# Altium schematic sheet AWG_USB_Serial_Quad.SchDoc: RFSOC SAWG
size 420 x 297 mm; Author: Paweł Kulik; DrawnBy: G.Kasprowicz; Address1: Warsaw Univeristy of Technology; Address2: Nowowiejska 15/19; DocumentNumber: 9; Revision: 1; SheetNumber: 9; SheetTotal: 20; EDA_Number: ARTIQ; Projet: ARTIQ/SINARA; ModifiedBy: -; CheckedDate: -; Title2: USB Serial Quad; DivGrp: ISE; Designer: G.Kasprowicz; ProjectName: ARTIQ/SINARA
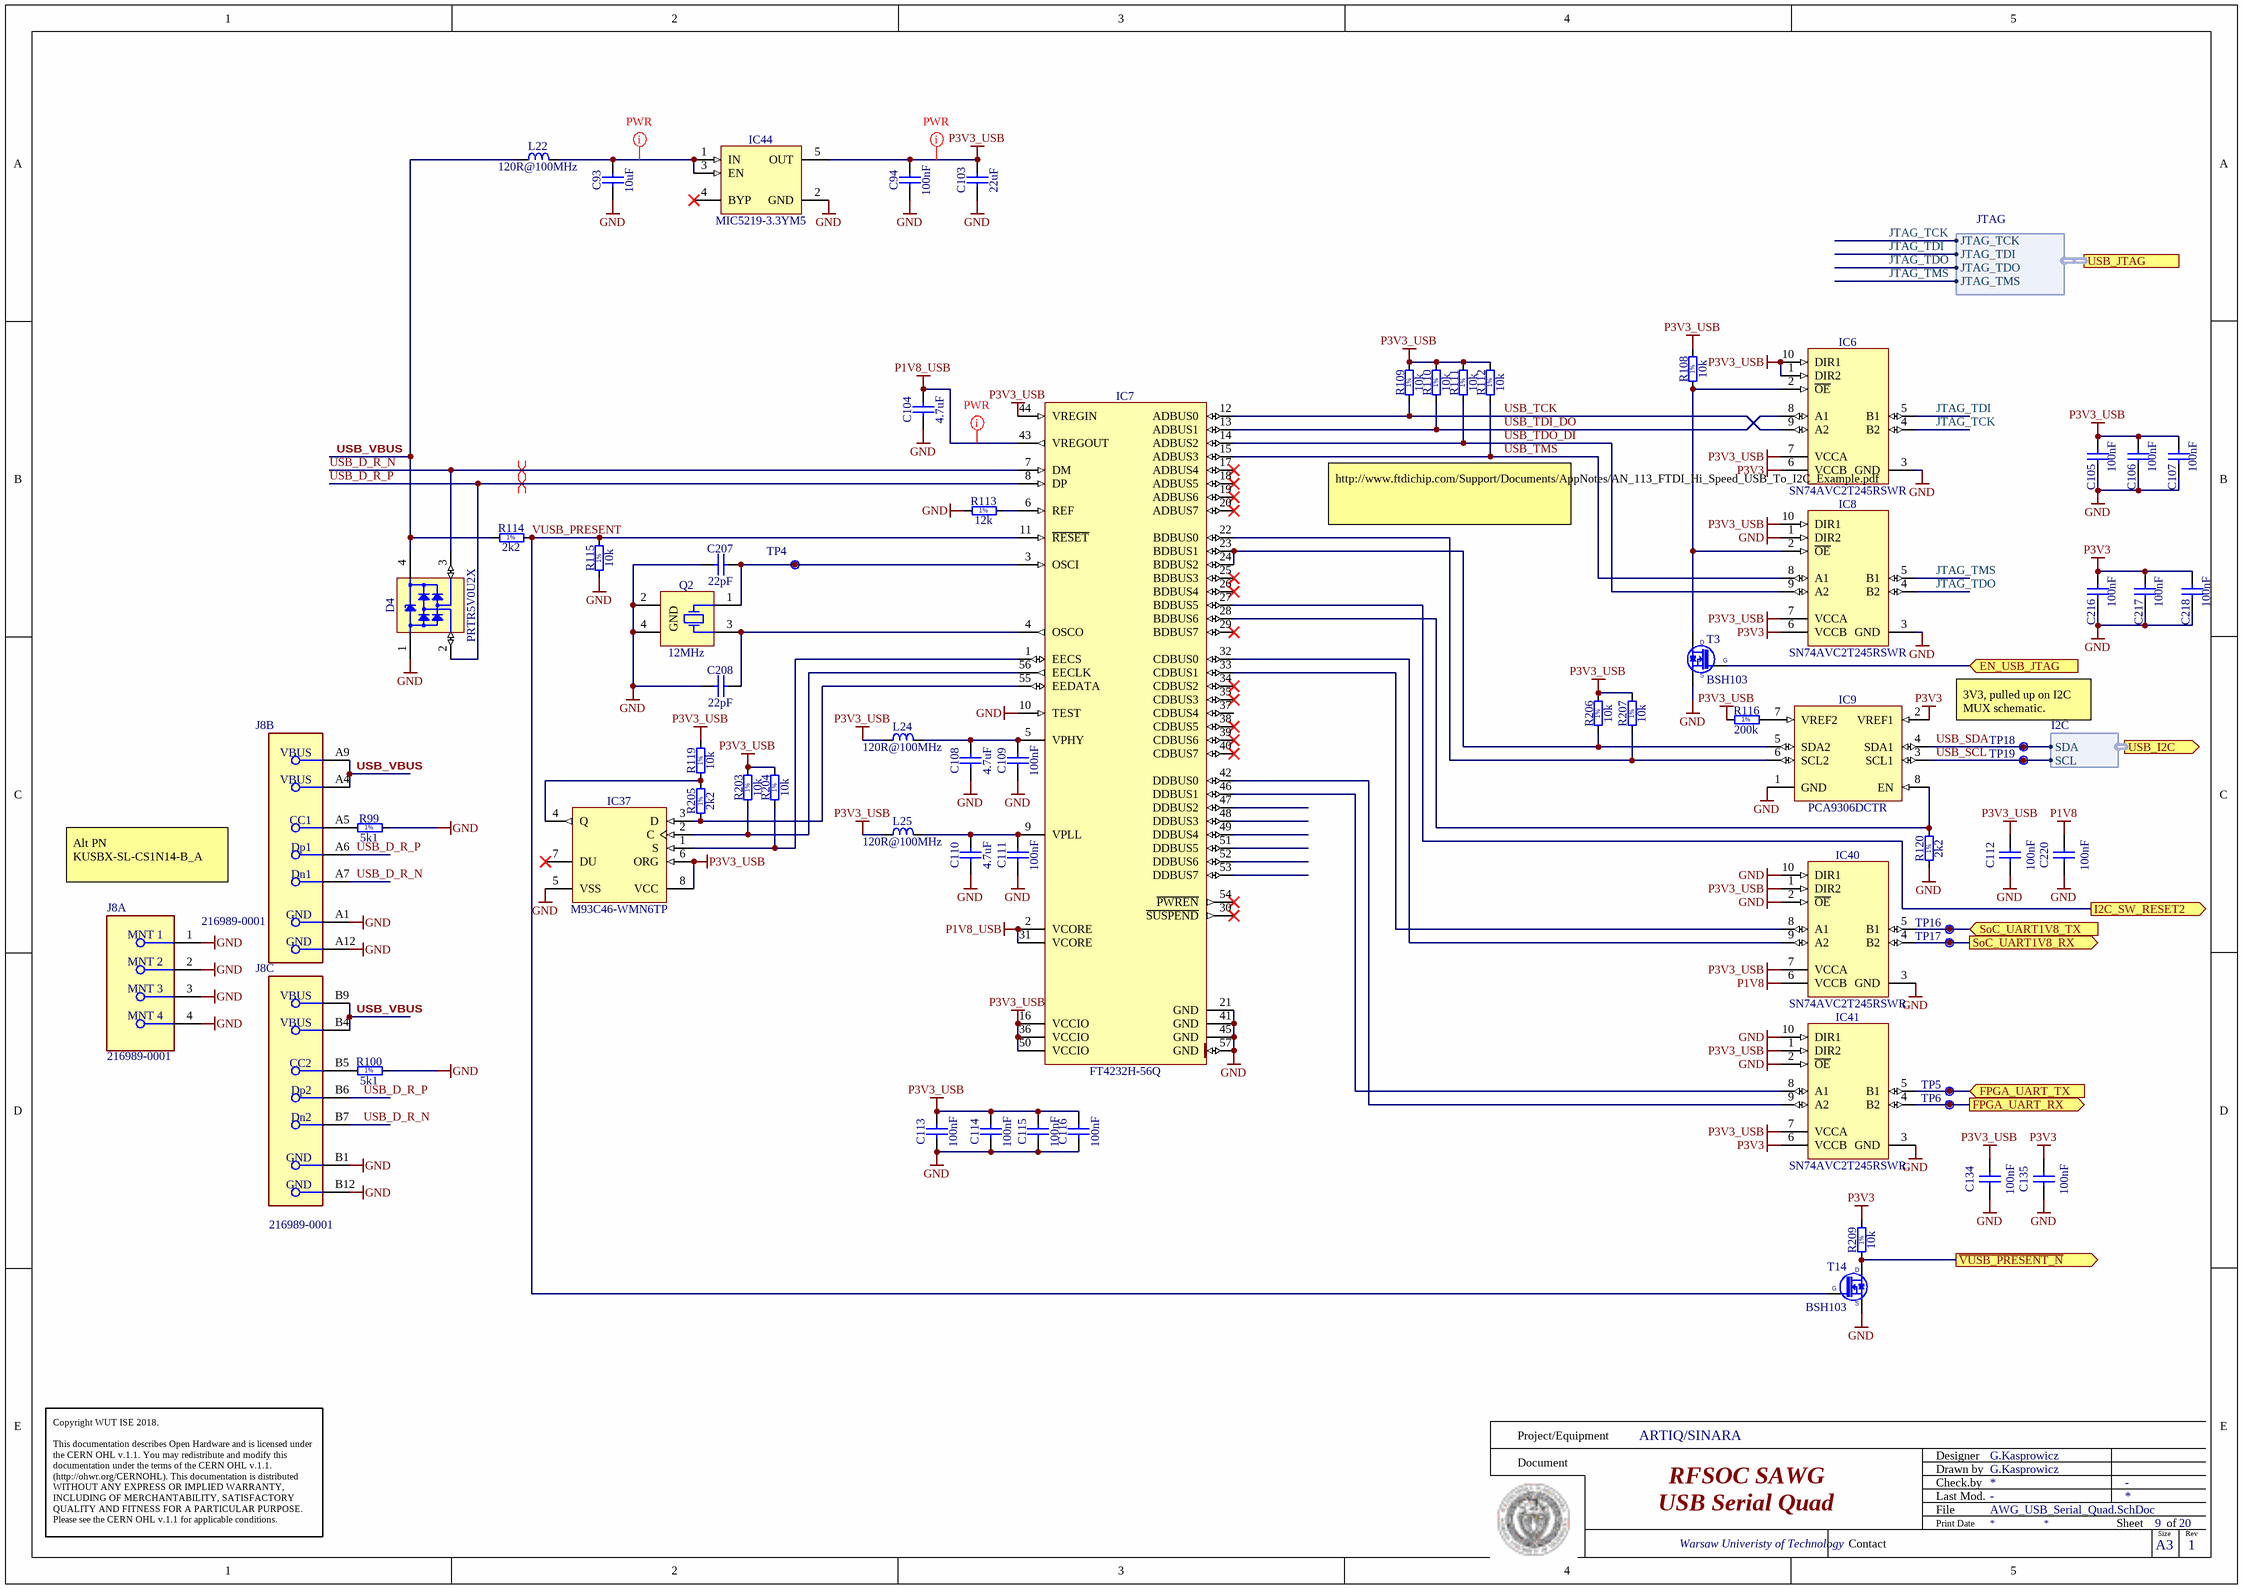
[diagram p0: AWG_USB_Serial_Quad.SchDoc]

## Parts
C93  10uF  [CAPC1608X87N]
C94  100nF  [CAPC1005X55N]
C103  22uF  [CAPC1608X90N]
C104  4.7uF  [CAPC2012X135N]
C105  100nF  [CAPC0603X33N]
C106  100nF  [CAPC0603X33N]
C107  100nF  [CAPC0603X33N]
C108  4.7uF  [CAPC2012X135N]
C109  100nF  [CAPC1005X55N]
C110  4.7uF  [CAPC2012X135N]
C111  100nF  [CAPC1005X55N]
C112  100nF  [CAPC0603X33N]
C113  100nF  [CAPC1005X55N]
C114  100nF  [CAPC1005X55N]
C115  100nF  [CAPC1005X55N]
C116  100nF  [CAPC1005X55N]
C134  100nF  [CAPC0603X33N]
C135  100nF  [CAPC0603X33N]
C207  22pF  [CAPC1005X55N]
C208  22pF  [CAPC1005X55N]
C216  100nF  [CAPC0603X33N]
C217  100nF  [CAPC0603X33N]
C218  100nF  [CAPC0603X33N]
C220  100nF  [CAPC0603X33N]
D4  PRTR5V0U2X  [SOT190P230X110-4N]
IC6  SN74AVC2T245RSWR  [QFN40P140X180X55-10N]
IC7  FT4232H-56Q  [QFN50P800X800X100-57N-S620]
IC8  SN74AVC2T245RSWR  [QFN40P140X180X55-10N]
IC9  PCA9306DCTR  [SOP65P400X130-8N]
IC37  M93C46-WMN6TP  [SOIC127P600X175-8N]
IC40  SN74AVC2T245RSWR  [QFN40P140X180X55-10N]
IC41  SN74AVC2T245RSWR  [QFN40P140X180X55-10N]
IC44  MIC5219-3.3YM5  [SOT95P280X145-5N]
J8  216989-0001  [FP-216989-0001-MFG]  (parts A,B,C of 3)
L22  120R@100MHz  [INDC1608X65N]
L24  120R@100MHz  [INDC1608X65N]
L25  120R@100MHz  [INDC1608X65N]
Q2  12MHz  [XTAL_TXC_7M]
R99  5k1  [RESC1005X40N]
R100  5k1  [RESC1005X40N]
R108  10k  [RESC1005X40N]
R109  10k  [RESC1005X40N]
R110  10k  [RESC1005X40N]
R111  10k  [RESC1005X40N]
R112  10k  [RESC1005X40N]
R113  12k  [RESC1005X40N]
R114  2k2  [RESC1005X40N]
R115  10k  [RESC1005X40N]
R116  200k  [RESC1005X40N]
R119  10k  [RESC1005X40N]
R120  2k2  [RESC1005X40N]
R203  10k  [RESC1005X40N]
R204  10k  [RESC1005X40N]
R205  2k2  [RESC1005X40N]
R206  10k  [RESC1005X40N]
R207  10k  [RESC1005X40N]
R209  10k  [RESC1005X40N]
T3  BSH103  [SOT95P230X110-3N]
T14  BSH103  [SOT95P230X110-3N]
TP4  Test Point  [TPS127]  (value not drawn)  (no BOM)
TP5  Test Point  [TPS127]  (value not drawn)  (no BOM)
TP6  Test Point  [TPS127]  (value not drawn)  (no BOM)
TP16  Test Point  [TPS127]  (value not drawn)  (no BOM)
TP17  Test Point  [TPS127]  (value not drawn)  (no BOM)
TP18  Test Point  [TPS127]  (value not drawn)  (no BOM)
TP19  Test Point  [TPS127]  (value not drawn)  (no BOM)

## Ports
EN_USB_JTAG (in), FPGA_UART_RX (out), FPGA_UART_TX (in), I2C_SW_RESET2 (out), SoC_UART1V8_RX (out), SoC_UART1V8_TX (in), USB_I2C (out, harness I2C), USB_JTAG (harness JTAG), ~{VUSB_PRESENT_N} (out)

## Harnesses
JTAG: JTAG_TCK, JTAG_TDI, JTAG_TDO, JTAG_TMS
I2C: SDA, SCL

## Nets
GND: C93.1 C94.1 C103.1 C104.1 C105.1 C106.1 C107.1 C108.1 C109.1 C110.1 C111.1 C112.1 C113.1 C114.1 C115.1 C116.1 C134.1 C135.1 C207.1 C208.1 C216.1 C217.1 C218.1 C220.1 D4.1(GND) IC6.3(GND) IC7.10(TEST) IC7.21(GND) IC7.41(GND) IC7.45(GND) IC7.57(GND) IC8.1(DIR2) IC8.3(GND) IC9.1(GND) IC37.5(VSS) IC40.2(~{OE}) IC40.3(GND) IC40.10(DIR1) IC41.2(~{OE}) IC41.3(GND) IC41.10(DIR1) IC44.2(GND) J8.1(MNT_1) J8.2(MNT_2) J8.3(MNT_3) J8.4(MNT_4) J8.A1(GND) J8.A12(GND) J8.B1(GND) J8.B12(GND) Q2.2(GND) Q2.4(GND) R99.2 R100.2 R113.1 R115.1 R120.1 T3.2(S) T14.2(S)
P1V8: C220.2 IC40.6(VCCB)
P1V8_USB: C104.2 IC7.2(VCORE) IC7.31(VCORE) IC7.43(VREGOUT)
P3V3: C135.2 C216.2 C217.2 C218.2 IC6.6(VCCB) IC8.6(VCCB) IC9.2(VREF1) IC41.6(VCCB) R209.2
P3V3_USB: C94.2 C103.2 C105.2 C106.2 C107.2 C112.2 C113.2 C114.2 C115.2 C116.2 C134.2 IC6.1(DIR2) IC6.7(VCCA) IC6.10(DIR1) IC7.16(VCCIO) IC7.36(VCCIO) IC7.44(VREGIN) IC7.50(VCCIO) IC8.7(VCCA) IC8.10(DIR1) IC37.6(ORG) IC37.8(VCC) IC40.1(DIR2) IC40.7(VCCA) IC41.1(DIR2) IC41.7(VCCA) IC44.5(OUT) L24.1 L25.1 R108.2 R109.2 R110.2 R111.2 R112.2 R116.1 R119.2 R203.2 R204.2 R206.2 R207.2
~{VUSB_PRESENT_N}: R209.1 T14.3(D) ; port ~{VUSB_PRESENT_N}
EN_USB_JTAG: T3.1(G) ; port EN_USB_JTAG
FPGA_UART_RX: IC41.4(B2) TP6.1 ; port FPGA_UART_RX
FPGA_UART_TX: IC41.5(B1) TP5.1 ; port FPGA_UART_TX
I2C_SW_RESET2: IC7.27(BDBUS5) ; port I2C_SW_RESET2
JTAG_TCK: IC6.4(B2) ; port USB_JTAG.JTAG_TCK
JTAG_TDI: IC6.5(B1) ; port USB_JTAG.JTAG_TDI
JTAG_TDO: IC8.4(B2) ; port USB_JTAG.JTAG_TDO
JTAG_TMS: IC8.5(B1) ; port USB_JTAG.JTAG_TMS
SoC_UART1V8_RX: IC40.4(B2) TP17.1 ; port SoC_UART1V8_RX
SoC_UART1V8_TX: IC40.5(B1) TP16.1 ; port SoC_UART1V8_TX
USB_D_R_N: D4.3(I/O2) IC7.7(DM) J8.A7(Dn1) J8.B7(Dn2)
USB_D_R_P: D4.2(I/O1) IC7.8(DP) J8.A6(Dp1) J8.B6(Dp2)
USB_SCL: IC9.3(SCL1) TP19.1 ; port USB_I2C.SCL
USB_SDA: IC9.4(SDA1) TP18.1 ; port USB_I2C.SDA
USB_TCK: IC6.9(A2) IC7.12(ADBUS0) R109.1
USB_TDI_DO: IC6.8(A1) IC7.13(ADBUS1) R110.1
USB_TDO_DI: IC7.14(ADBUS2) IC8.9(A2) R111.1
USB_TMS: IC7.15(ADBUS3) IC8.8(A1) R112.1
USB_VBUS: D4.4(VCC) J8.A4(VBUS) J8.A9(VBUS) J8.B4(VBUS) J8.B9(VBUS) L22.1 R114.1
VUSB_PRESENT: IC7.11(~{RESET}) R114.2 R115.2 T14.1(G)
NetC93_2: C93.2 IC44.1(IN) IC44.3(EN) L22.2
NetC108_2: C108.2 C109.2 IC7.5(VPHY) L24.2
NetC110_2: C110.2 C111.2 IC7.9(VPLL) L25.2
NetC207_2: C207.2 IC7.3(OSCI) Q2.1(X) TP4.1
NetC208_2: C208.2 IC7.4(OSCO) Q2.3(X)
NetIC6_2: IC6.2(~{OE}) IC8.2(~{OE}) R108.1 T3.3(D)
NetIC7_1: IC7.1(EECS) IC37.1(S) R204.1
NetIC7_6: IC7.6(REF) R113.2
NetIC7_22: IC7.22(BDBUS0) IC9.6(SCL2) R207.1
NetIC7_23: IC7.23(BDBUS1) IC7.24(BDBUS2) IC9.5(SDA2) R206.1
NetIC7_28: IC7.28(BDBUS6) IC9.8(EN) R120.2
NetIC7_32: IC7.32(CDBUS0) IC40.9(A2)
NetIC7_33: IC7.33(CDBUS1) IC40.8(A1)
NetIC7_42: IC7.42(DDBUS0) IC41.9(A2)
NetIC7_46: IC7.46(DDBUS1) IC41.8(A1)
NetIC7_55: IC7.55(EEDATA) IC37.3(D) R205.2
NetIC7_56: IC7.56(EECLK) IC37.2(C) R203.1
NetIC9_7: IC9.7(VREF2) R116.2
NetIC37_4: IC37.4(Q) R119.1 R205.1
NetJ8_A5: J8.A5(CC1) R99.1
NetJ8_B5: J8.B5(CC2) R100.1

Not connected (* = marked no-connect by the designer): IC7 17(ADBUS4)* 18(ADBUS5)* 19(ADBUS6)* 20(ADBUS7)* 25(BDBUS3)* 26(BDBUS4)* 29(BDBUS7)* 30(~{SUSPEND})* 34(CDBUS2)* 35(CDBUS3)* 37(CDBUS4) 38(CDBUS5)* 39(CDBUS6)* 40(CDBUS7)* 47(DDBUS2) 48(DDBUS3) 49(DDBUS4) 51(DDBUS5) 52(DDBUS6) 53(DDBUS7) 54(~{PWREN})*; IC37 7(DU)*; IC44 4(BYP)*

## Layout directives
differential pair; differential pair class Diff_90Ohm: USB_D_R_N, USB_D_R_P
net class PWR: NetC93_2, P1V8_USB, P3V3_USB

## Notes on the sheet
- http://www.ftdichip.com/Support/Documents/AppNotes/AN_113_FTDI_Hi_Speed_USB_To_I2C_Example.pdf
- 3V3, pulled up on I2C MUX schematic.
- Alt PN KUSBX-SL-CS1N14-B_A
- Project/Equipment
- Document
- Designer
- Drawn by
- Check.by
- Copyright WUT ISE 2018.
  This documentation describes Open Hardware and is licensed under the CERN OHL v.1.1. You may redistribute and modify this documentation under the terms of the CERN OHL v.1.1. (http://ohwr.org/CERNOHL). This documentation is distributed WITHOUT ANY EXPRESS OR IMPLIED WARRANTY, INCLUDING OF MERCHANTABILITY, SATISFACTORY QUALITY AND FITNESS FOR A PARTICULAR PURPOSE. Please see the CERN OHL v.1.1 for applicable conditions.
- Contact
- File
- Last Mod.
- Print Date
- Sheet
- Size
- A3
- of
- Rev
- (in symbol R0402_2K2_1%_0.0625W_100PPM) 1%
- (in symbol R0402_5K1_1%_0.0625W_100PPM) 1%
- (in symbol R0402_10K_1%_0.0625W_100PPM) 1%
- (in symbol R0402_12K_1%_0.0625W_100PPM) 1%
- (in symbol R0402_200K_1%_0.0625W_100PPM) 1%

## Library data of the parts
C93 = CC0603_10UF_6.3V_20%_X5R: Non-polarised capacitor; Part Description: SMD Multilayer Chip Ceramic Capacitor; Manufacturer: GENERIC; Manufacturer1 Part Number: C0603C106M9PAC; Voltage: 6.3V; TC: X5R; Tolerance: ±20%; Part Number: CC0603_10UF_6.3V_20%_X5R; Component Kind: Standard; Component Type: Standard; Pin Count: 2; Value: 10uF; Status: Preferred; Manufacturer Part Number: CC0603_10uF_6.3V_20%_X5R; Case: 0603; Mounted: Yes; Socket: No; SMD: Yes; Sense: No; Manufacturer1 Example: KEMET; Manufacturer1 ComponentHeight: 0.95mm; HelpURL: \\cern.ch\dfs\Applications\Altium\Datasheets\CC0603_X5R_KEMET.pdf; Author: CERN DEM JLC; CreateDate: 2007-12-03; LatestRevisionDate: 2007-12-03
C94 C109 C111 C113-C116 = CC0402_100NF_16V_10%_X5R: Non-polarised capacitor; Part Description: SMD Multilayer Chip Ceramic Capacitor; Manufacturer: GENERIC; Manufacturer1 Part Number: GRM155R61C104KA88D; Voltage: 16V; TC: X5R; Tolerance: ±10%; Part Number: CC0402_100NF_16V_10%_X5R; Component Kind: Standard; Component Type: Standard; Pin Count: 2; Value: 100nF; Status: None; Manufacturer Part Number: CC0402_100NF_16V_10%_X5R; Case: 0402; Mounted: Yes; Socket: No; SMD: Yes; Sense: No; Manufacturer1 Example: MURATA; Manufacturer1 ComponentHeight: 0.55mm; HelpURL: \\cern.ch\dfs\Applications\Altium\Datasheets\CC0402_X5R_MURATA_GRM.pdf; Author: CERN DEM JLC; CreateDate: 10.12.2013; LatestRevisionDate: 10.12.2013
C103 = CC0603_22UF_6.3V_20%_X5R: Non-polarised capacitor; Part Description: SMD Multilayer Chip Ceramic Capacitor; Manufacturer: GENERIC; Manufacturer1 Part Number: C1608X5R0J226M080; Voltage: 6.3V; TC: X5R; Tolerance: ±20%; Part Number: CC0603_22UF_6.3V_20%_X5R; Component Kind: Standard; Component Type: Standard; Pin Count: 2; Value: 22uF; Status: None; Manufacturer Part Number: CC0603_22UF_6.3V_20%_X5R; Case: 0603; Mounted: Yes; Socket: No; SMD: Yes; Sense: No; Manufacturer1 Example: TDK; Manufacturer1 ComponentHeight: 0.9mm; HelpURL: \\cern.ch\dfs\Applications\Altium\Datasheets\CC0603_X5R_TDK_C.pdf; Author: CERN DEM JLC; CreateDate: 16.12.2013; LatestRevisionDate: 03.12.2020
C104 C108 C110 = CC0805_4.7UF_10V_10%_X5R: Non-polarised capacitor; Part Description: SMD Multilayer Chip Ceramic Capacitor; Manufacturer: GENERIC; Manufacturer1 Part Number: 222224013672; Voltage: 10V; TC: X5R; Tolerance: ±10%; Part Number: CC0805_4.7UF_10V_10%_X5R; Component Kind: Standard; Component Type: Standard; Pin Count: 2; Value: 4.7uF; Status: Preferred; Manufacturer Part Number: CC0805_4.7UF_10V_10%_X5R; Case: 0805; Mounted: Yes; Socket: No; SMD: Yes; Sense: No; Manufacturer1 Example: PHYCOMP; Manufacturer1 ComponentHeight: 1.45mm; HelpURL: \\cern.ch\dfs\Applications\Altium\Datasheets\CC0805_X5R_PHYCOMP_HC.pdf; Author: CERN DEM JLC; CreateDate: 03.12.2007; LatestRevisionDate: 03.12.2007
C105-C107 C112 C134 C135 C216-C218 C220 = CC0201_100NF_6.3V_10%_X5R: Non-polarised capacitor; Part Description: SMD Multilayer Chip Ceramic Capacitor; Manufacturer: GENERIC; Manufacturer1 Part Number: 02016D104KAT2A; Voltage: 6.3V; TC: X5R; Tolerance: ±10%; Part Number: CC0201_100NF_6.3V_10%_X5R; Component Kind: Standard; Component Type: Standard; Pin Count: 2; Value: 100nF; Status: Not Recommended; Manufacturer Part Number: CC0201_100NF_6.3V_10%_X5R; Case: 0201; Mounted: Yes; Socket: No; SMD: Yes; Sense: No; Manufacturer1 Example: AVX; Manufacturer1 ComponentHeight: 0.33mm; HelpURL: \\cern.ch\dfs\Applications\Altium\Datasheets\CC0201_X5R_AVX.pdf; Author: CERN DEM JLC; CreateDate: 2007-12-03; LatestRevisionDate: 2007-12-03
C207 C208 = CC0402_22PF_50V_5%_C0G: Non-polarised capacitor; Part Description: SMD Multilayer Chip Ceramic Capacitor; Manufacturer: GENERIC; Manufacturer1 Part Number: C0402C220J5GACTU; Voltage: 50V; TC: C0G/NP0; Tolerance: ±5%; Part Number: CC0402_22PF_50V_5%_C0G; Component Kind: Standard; Component Type: Standard; Pin Count: 2; Value: 22pF; Status: Preferred; Manufacturer Part Number: CC0402_22PF_50V_5%_C0G; Case: 0402; Mounted: Yes; Socket: No; SMD: Yes; Sense: No; Manufacturer1 Example: KEMET; Manufacturer1 ComponentHeight: 0.55mm; HelpURL: \\cern.ch\dfs\Applications\Altium\Datasheets\CC0805_C0G_KEMET_(Commercial Grade).pdf; Author: CERN DEM JLC; CreateDate: 03.12.2007; LatestRevisionDate: 03.12.2007
D4 = PRTR5V0U2X: Ultra Low Capacitance Double Rail-to-Rail ESD Protection Diode; Part Description: Ultra Low Capacitance (1pF) Double Rail-to-Rail ESD Protection Diode (8kV); Manufacturer: NXP SEMICONDUCTORS; Voltage: 5.5V; PressFit: No; Bonding: No; Part Number: PRTR5V0U2X; Component Kind: Standard; Component Type: Standard; Device: PRTR5V0U2X; PackageDescription: SOT143B, SOT, 1.90mm Pitch; 4 Pin, 1.30mm W X 2.90mm L X 1.10mm H body, IPC Medium Density; Manufacturer Part Number: PRTR5V0U2X; Pin Count: 4; Case: SOT143B; Mounted: Yes; Socket: No; SMD: Yes; Sense: No; ComponentHeight: 1.1mm; HelpURL: \\cern.ch\dfs\Applications\Altium\Datasheets\PRTR5V0U2X.pdf; Author: CERN DEM JLC; CreateDate: 22.03.2011; LatestRevisionDate: 22.03.2011
IC6 IC8 IC40 IC41 = SN74AVC2T245RSWR: Dual-Bit Dual-Supply Bus Transceiver With Configurable Voltage Translation and 3-State Outputs; Manufacturer: TEXAS INSTRUMENTS; PressFit: No; Bonding: No; Part Number: SN74AVC2T245RSWR; Component Kind: Standard; Component Type: Standard; Device: SN74AVC2T245RSWR; PackageDescription: QFN, 0.40mm Pitch, Rect.;10 Pin, 1.80mm L X 1.40mm W X 0.55mm H Body, IPC Medium Density; Status: Not Recommended; Part Description: Dual-Bit Dual-Supply Bus Transceiver With Configurable Voltage Translation and 3-State Outputs; Manufacturer Part Number: SN74AVC2T245RSWR; Pin Count: 10; Case: QFN10; Mounted: Yes; Socket: No; SMD: Yes; Sense: No; ComponentHeight: 0.55mm; Author: CERN DEM JLC; HelpURL: \\cern.ch\dfs\Applications\Altium\Datasheets\SN74AVC2T245RSWR.pdf; CreateDate: 07.07.2014; LatestRevisionDate: 30.03.2017
IC7 = FT4232H-56Q: Quad High Speed USB to Multipurpose UART/MPSSE IC; Manufacturer: FUTURE TECHNOLOGY DEVICES INTERNATIONAL (FTDI); PressFit: No; Bonding: No; Part Number: FT4232H-56Q; Component Kind: Standard; Component Type: Standard; Device: FT4232H-56Q; PackageDescription: QFN, 0.50mm Pitch, Square; 56 Pin, 8.00mm L X 8.00mm W X 1.00mm H body (6.1mm X 6.1mm Thermal tab), IPC Medium Density; Part Description: Quad High Speed USB to Multipurpose UART/MPSSE IC; Manufacturer Part Number: FT4232H-56Q; Pin Count: 57; Case: QFN56; Mounted: Yes; Socket: No; SMD: Yes; Sense: No; ComponentHeight: 1mm; Author: CERN DEM JLC; HelpURL: \\cern.ch\dfs\Applications\Altium\Datasheets\FT4232H-56Q.pdf; CreateDate: 11.10.2016; LatestRevisionDate: 11.10.2016
IC9 = PCA9306DCTR: Dual Bidirectional I2C Bus And SMBus Voltage-Level Translator; Manufacturer: TEXAS INSTRUMENTS; PressFit: No; Bonding: No; Part Number: PCA9306DCTR; Component Kind: Standard; Component Type: Standard; Device: PCA9306DCTR; PackageDescription: SOP, 0.65mm, Pitch; 8 Pin, 2.80mm W X 2.95mm L X 1.30mm H Body, PC Medium Density; Part Description: Dual Bidirectional I2C Bus And SMBus Voltage-Level Translator; Manufacturer Part Number: PCA9306DCTR; Pin Count: 8; Case: SSOP8; Mounted: Yes; Socket: No; SMD: Yes; Sense: No; ComponentHeight: 1.3mm; Author: CERN DEM JLC; HelpURL: \\cern.ch\dfs\Applications\Altium\Datasheets\PCA9306DCTR.pdf; CreateDate: 25.02.2013; LatestRevisionDate: 11.02.2016
IC37 = M93C46-WMN6TP: 2.5 to 5.5 V, 1Kb (128x8) Serial Microwire Bus EEPROM; Part Description: 1Kbit (128 x 8 bit or 64 x 16 bit) MICROWIRE® Serial Access EEPROM; Manufacturer: ST MICROELECTRONICS; PressFit: No; Bonding: No; Part Number: M93C46-WMN6TP; Component Kind: Standard; Component Type: Standard; Device: M93C46-WMN6TP; PackageDescription: SOIC 8, Pitch 1.27mm - Body 4x5mm, IPC Medium Density; Manufacturer Part Number: M93C46-WMN6TP; Pin Count: 8; Case: SOIC8; Mounted: Yes; Socket: No; SMD: Yes; Sense: No; ComponentHeight: 1.75mm; HelpURL: \\cern.ch\dfs\Applications\Altium\Datasheets\M93C46-WMN6TP.pdf; Author: CERN DEM JLC; CreateDate: 15.11.2012; LatestRevisionDate: 15.11.2012
IC44 = MIC5219-3.3YM5: 500mA Peak Output LDO Regulator; Part Description: 3.3V 500mA Peak Output Low Drop-Out  (LDO) Regulator; Manufacturer: MICROCHIP TECHNOLOGY; PressFit: No; Bonding: No; Part Number: MIC5219-3.3YM5; Component Kind: Standard; Component Type: Standard; Device: MIC5219-3.3YM5; PackageDescription: SOT, 0.95mm pitch; 5 pin, 1.60mm W X 2.90mm L X 1.45mm H body, IPC Medium Density; Manufacturer Part Number: MIC5219-3.3YM5; Pin Count: 5; Case: SOT23-5; Mounted: Yes; Socket: No; SMD: Yes; Sense: No; ComponentHeight: 1.45mm; HelpURL: \\cern.ch\dfs\Applications\Altium\Datasheets\MIC5219-3.3YM5.pdf; Author: CERN DEM WB; CreateDate: 2019-04-16; LatestRevisionDate: 2019-04-16
J8 = CMP-04767-000020-1: CONN RCPT USB2.0 TYPE C 24POS RA; Manufacturer Part Number: 216989-0001
L22 L24 L25 = IND0603_MURATA_BLM18SG121TN1D: Inductor; Part Description: SMD EMIFIL Suppression Chip Ferrite Bead; Manufacturer: MURATA; Power: 3A; Resistance: 0.025R; Tolerance: ±25%; Part Number: IND0603_MURATA_BLM18SG121TN1D; Component Kind: Standard; Component Type: Standard; Pin Count: 2; Value: 120R@100MHz; Status: None; Manufacturer Part Number: BLM18SG121TN1D; Case: 0603; Mounted: Yes; Socket: No; SMD: Yes; Sense: No; ComponentHeight: 0.65mm; HelpURL: \\cern.ch\dfs\Applications\Altium\Datasheets\IND0603_MURATA_BLM18S.pdf; Author: CERN DEM JLC; CreateDate: 23.07.2014; LatestRevisionDate: 23.07.2014
Q2 = XTAL_12MHZ_TXC_7M-12.000MAAJ-T: Crystal 4 pins 1=XTAL Control 2=GND3=XTAL 4=GND; Part Description: ±30ppm 18pF -20°C to +70°C  4 Pins, 3.2x2.5X0.8mm, SMD Sealing Crystal, 7M Series; Manufacturer: TXC CORPORATION; PressFit: No; Bonding: No; Part Number: XTAL_12MHZ_TXC_7M-12.000MAAJ-T; Component Kind: Standard; Component Type: Standard; PackageDescription: 4 Pins, 2.5x3.2mm, SMD Sealing Crystal, 7M Serie; Value: 12MHz; Manufacturer Part Number: 7M-12.000MAAJ-T; Pin Count: 4; Mounted: Yes; Socket: No; SMD: Yes; Sense: No; ComponentHeight: 0.8mm; HelpURL: \\cern.ch\dfs\Applications\Altium\Datasheets\XTAL_TXC_7M.pdf; Author: CERN DEM JLC; CreateDate: 19.06.2012; LatestRevisionDate: 19.06.2012
R99 R100 = R0402_5K1_1%_0.0625W_100PPM: Resistor - 1%; Part Description: General Purpose Thick Film Chip Resistor; Manufacturer: GENERIC; Manufacturer1 Part Number: 232270675102L; TC: ±100ppm/°C; PressFit: No; Part Number: R0402_5K1_1%_0.0625W_100PPM; Component Kind: Standard; Component Type: Standard; Pin Count: 2; Value: 5k1; Status: Not Recommended; Power: 0.0625W; Tolerance: ±1%; Manufacturer Part Number: R0402_5K1_1%_0.0625W_100PPM; Case: 0402; Mounted: Yes; Sense: No; Socket: No; SMD: Yes; Manufacturer1 Example: YAGEO PHYCOMP; Manufacturer1 ComponentHeight: 0.4mm; HelpURL: \\cern.ch\dfs\Applications\Altium\Datasheets\R0402_Phycomp_RC0402.pdf; Author: CERN DEM JLC; CreateDate: 03.12.2007; LatestRevisionDate: 17.10.2012
R108-R112 R115 R119 R203 R204 R206 R207 R209 = R0402_10K_1%_0.0625W_100PPM: Resistor - 1%; Part Description: General Purpose Thick Film Chip Resistor; Manufacturer: GENERIC; Manufacturer1 Part Number: 232270671003L; TC: ±100ppm/°C; PressFit: No; Part Number: R0402_10K_1%_0.0625W_100PPM; Component Kind: Standard; Component Type: Standard; Pin Count: 2; Value: 10k; Status: Not Recommended; Power: 0.0625W; Tolerance: ±1%; Manufacturer Part Number: R0402_10K_1%_0.0625W_100PPM; Case: 0402; Mounted: Yes; Socket: No; SMD: Yes; Manufacturer1 Example: YAGEO PHYCOMP; Manufacturer1 ComponentHeight: 0.4mm; HelpURL: \\cern.ch\dfs\Applications\Altium\Datasheets\R0402_Phycomp_RC0402.pdf; Author: CERN DEM JLC; CreateDate: 03.12.2007; LatestRevisionDate: 17.10.2012; Sense: No
R113 = R0402_12K_1%_0.0625W_100PPM: Resistor - 1%; Part Description: General Purpose Thick Film Chip Resistor; Manufacturer: GENERIC; Manufacturer1 Part Number: 232270671203L; TC: ±100ppm/°C; PressFit: No; Part Number: R0402_12K_1%_0.0625W_100PPM; Component Kind: Standard; Component Type: Standard; Pin Count: 2; Value: 12k; Status: Not Recommended; Power: 0.0625W; Tolerance: ±1%; Manufacturer Part Number: R0402_12K_1%_0.0625W_100PPM; Case: 0402; Mounted: Yes; Sense: No; Socket: No; SMD: Yes; Manufacturer1 Example: YAGEO PHYCOMP; Manufacturer1 ComponentHeight: 0.4mm; HelpURL: \\cern.ch\dfs\Applications\Altium\Datasheets\R0402_Phycomp_RC0402.pdf; Author: CERN DEM JLC; CreateDate: 03.12.2007; LatestRevisionDate: 17.10.2012
R114 R120 R205 = R0402_2K2_1%_0.0625W_100PPM: Resistor - 1%; Part Description: General Purpose Thick Film Chip Resistor; Manufacturer: GENERIC; Manufacturer1 Part Number: 232270672202L; TC: ±100ppm/°C; PressFit: No; Part Number: R0402_2K2_1%_0.0625W_100PPM; Component Kind: Standard; Component Type: Standard; Pin Count: 2; Value: 2k2; Status: Not Recommended; Power: 0.0625W; Tolerance: ±1%; Manufacturer Part Number: R0402_2K2_1%_0.0625W_100PPM; Case: 0402; Mounted: Yes; Sense: No; Socket: No; SMD: Yes; Manufacturer1 Example: YAGEO PHYCOMP; Manufacturer1 ComponentHeight: 0.4mm; HelpURL: \\cern.ch\dfs\Applications\Altium\Datasheets\R0402_Phycomp_RC0402.pdf; Author: CERN DEM JLC; CreateDate: 03.12.2007; LatestRevisionDate: 17.10.2012
R116 = R0402_200K_1%_0.0625W_100PPM: Resistor - 1%; Part Description: General Purpose Thick Film Chip Resistor; Manufacturer: GENERIC; Manufacturer1 Part Number: 232270672004L; TC: ±100ppm/°C; PressFit: No; Part Number: R0402_200K_1%_0.0625W_100PPM; Component Kind: Standard; Component Type: Standard; Pin Count: 2; Value: 200k; Status: Not Recommended; Power: 0.0625W; Tolerance: ±1%; Manufacturer Part Number: R0402_200K_1%_0.0625W_100PPM; Case: 0402; Mounted: Yes; Sense: No; Socket: No; SMD: Yes; Manufacturer1 Example: YAGEO PHYCOMP; Manufacturer1 ComponentHeight: 0.4mm; HelpURL: \\cern.ch\dfs\Applications\Altium\Datasheets\R0402_Phycomp_RC0402.pdf; Author: CERN DEM JLC; CreateDate: 03.12.2007; LatestRevisionDate: 17.10.2012
T3 T14 = BSH103: N-CHANNEL MOSFET WITH DIODE; Part Description: 30V 850mA N-Channel Enhancement Mode Field-Effect Transistor; Manufacturer: NEXPERIA; PressFit: No; Bonding: No; Part Number: BSH103; Component Kind: Standard; Component Type: Standard; Device: BSH103; PackageDescription: SOT23, 3 pin, Pitch 0.95mm - 1.3mm W X 2.9mm L X 1.1mm H, IPC Medium Density; Manufacturer Part Number: BSH103; Pin Count: 3; Case: SOT23-3; Mounted: Yes; Socket: No; SMD: Yes; Sense: No; ComponentHeight: 1.1mm; HelpURL: \\cern.ch\dfs\Applications\Altium\Datasheets\BSH103.pdf; Author: CERN DEM JLC; CreateDate: 16.03.2010; LatestRevisionDate: 20.06.2017
TP4-TP6 TP16-TP19 = SMD_PAD_1.27X1.27MM: Part Description: 1.27mm x 1.27mm PCB Copper Area (SMD Test Point); Mounted: No; Part Number: SMD_PAD_1.27X1.27MM; Component Type: Standard (No BOM); Pin Count: 1; Family: Test Point; Socket: No; SMD: Yes; Sense: No; Status: None; ComponentHeight: 0mm; HelpURL: Undefined; Author: CERN DEM JLC; CreateDate: 12.01.2008; LatestRevisionDate: 12.01.2008; PackageDescription: 1.27mm x 1.27mm PCB Copper Area (SMD Test Point)